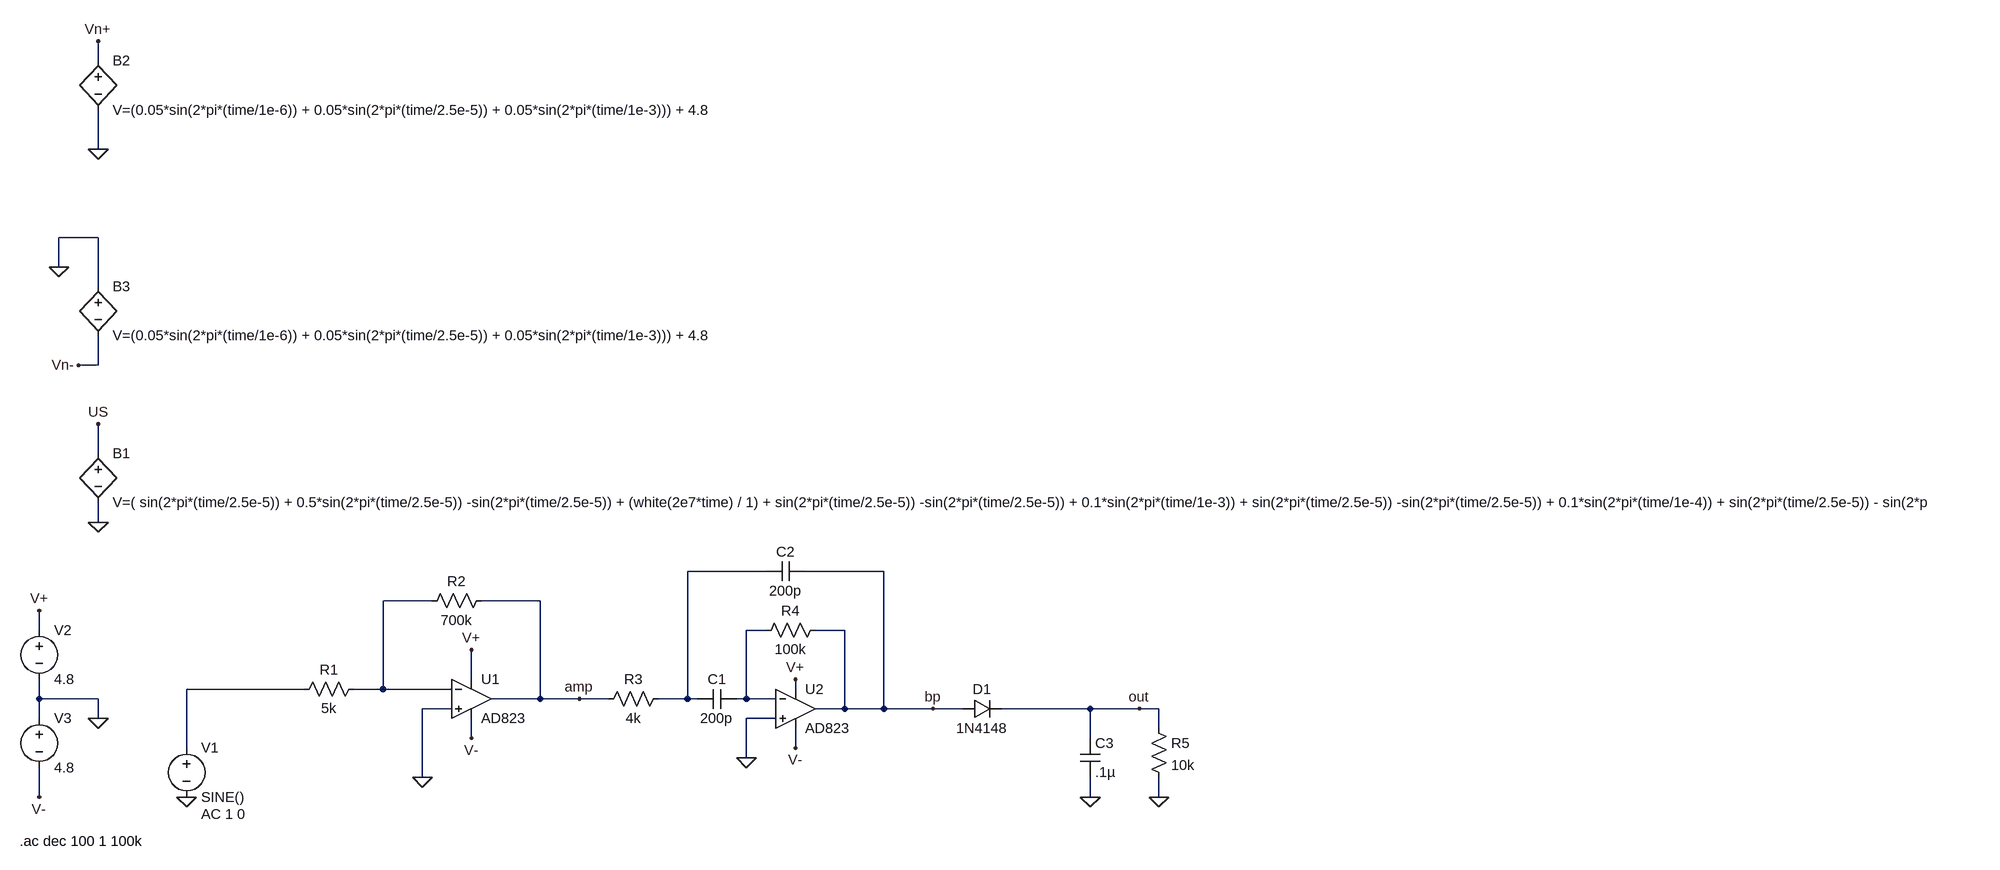
[diagram p0: schematic Simulation.asc]
Simulation.asc, the LTspice schematic file:
Version 4
SHEET 1 7124 680
WIRE -208 -1056 -208 -1088
WIRE -208 -912 -208 -976
WIRE -208 -768 -272 -768
WIRE -272 -720 -272 -768
WIRE -208 -688 -208 -768
WIRE -208 -560 -208 -608
WIRE -208 -560 -240 -560
WIRE -208 -416 -208 -464
WIRE -208 -304 -208 -336
WIRE 880 -224 752 -224
WIRE 1072 -224 944 -224
WIRE 336 -176 256 -176
WIRE 512 -176 416 -176
WIRE -304 -128 -304 -160
WIRE 880 -128 848 -128
WIRE 1008 -128 960 -128
WIRE 400 -48 400 -96
WIRE 128 -32 -64 -32
WIRE 256 -32 256 -176
WIRE 256 -32 208 -32
WIRE 368 -32 256 -32
WIRE 928 -32 928 -48
WIRE -304 -16 -304 -48
WIRE -208 -16 -304 -16
WIRE 512 -16 512 -176
WIRE 512 -16 432 -16
WIRE 576 -16 512 -16
WIRE 624 -16 576 -16
WIRE 752 -16 752 -224
WIRE 752 -16 704 -16
WIRE 768 -16 752 -16
WIRE 848 -16 848 -128
WIRE 848 -16 832 -16
WIRE 896 -16 848 -16
WIRE 368 0 320 0
WIRE 1008 0 1008 -128
WIRE 1008 0 960 0
WIRE 1072 0 1072 -224
WIRE 1072 0 1008 0
WIRE 1152 0 1072 0
WIRE 1200 0 1152 0
WIRE 1408 0 1264 0
WIRE 1488 0 1408 0
WIRE 1520 0 1488 0
WIRE -304 16 -304 -16
WIRE -208 16 -208 -16
WIRE 896 16 848 16
WIRE 1520 32 1520 0
WIRE 400 48 400 16
WIRE 1408 48 1408 0
WIRE -64 64 -64 -32
WIRE 928 64 928 32
WIRE 848 80 848 16
WIRE 320 112 320 0
WIRE -304 144 -304 96
WIRE 1408 144 1408 112
WIRE 1520 144 1520 112
FLAG 320 112 0
FLAG -208 16 0
FLAG -304 -160 V+
FLAG -304 144 V-
FLAG 400 -96 V+
FLAG 400 48 V-
FLAG 848 80 0
FLAG 928 -48 V+
FLAG 928 64 V-
FLAG -208 -304 0
FLAG -208 -464 US
FLAG 1408 144 0
FLAG 1520 144 0
FLAG 1488 0 out
FLAG 576 -16 amp
FLAG 1152 0 bp
FLAG -208 -1088 Vn+
FLAG -272 -720 0
FLAG -240 -560 Vn-
FLAG -208 -912 0
FLAG -64 144 0
SYMBOL res 224 -48 R90
WINDOW 0 0 56 VBottom 2
WINDOW 3 32 56 VTop 2
SYMATTR InstName R1
SYMATTR Value 5k
SYMBOL res 432 -192 R90
WINDOW 0 0 56 VBottom 2
WINDOW 3 32 56 VTop 2
SYMATTR InstName R2
SYMATTR Value 700k
SYMBOL voltage -304 -144 R0
WINDOW 123 0 0 Left 0
WINDOW 39 0 0 Left 0
SYMATTR InstName V2
SYMATTR Value 4.8
SYMBOL voltage -304 0 R0
WINDOW 123 0 0 Left 0
WINDOW 39 0 0 Left 0
SYMATTR InstName V3
SYMATTR Value 4.8
SYMBOL Opamps\\AD823 400 -80 R0
SYMATTR InstName U1
SYMBOL res 720 -32 R90
WINDOW 0 0 56 VBottom 2
WINDOW 3 32 56 VTop 2
SYMATTR InstName R3
SYMATTR Value 4k
SYMBOL res 976 -144 R90
WINDOW 0 0 56 VBottom 2
WINDOW 3 32 56 VTop 2
SYMATTR InstName R4
SYMATTR Value 100k
SYMBOL cap 832 -32 R90
WINDOW 0 0 32 VBottom 2
WINDOW 3 32 32 VTop 2
SYMATTR InstName C1
SYMATTR Value 200p
SYMBOL cap 944 -240 R90
WINDOW 0 0 32 VBottom 2
WINDOW 3 32 32 VTop 2
SYMATTR InstName C2
SYMATTR Value 200p
SYMBOL Opamps\\AD823 928 -64 R0
SYMATTR InstName U2
SYMBOL bv -208 -432 R0
SYMATTR InstName B1
SYMATTR Value V=( sin(2*pi*(time/2.5e-5)) + 0.5*sin(2*pi*(time/2.5e-5)) -sin(2*pi*(time/2.5e-5)) + (white(2e7*time) / 1) + sin(2*pi*(time/2.5e-5)) -sin(2*pi*(time/2.5e-5)) + 0.1*sin(2*pi*(time/1e-3)) + sin(2*pi*(time/2.5e-5)) -sin(2*pi*(time/2.5e-5)) + 0.1*sin(2*pi*(time/1e-4)) + sin(2*pi*(time/2.5e-5)) - sin(2*pi*(time/2.5e-5)) + 0.1*sin(2*pi*(time/1e-5)) + delay(sin(2*pi*(time/2.5e-5)), 0.5e-3) + delay(-sin(2*pi*(time/2.5e-5)), 1.0e-3) )/500
SYMBOL diode 1200 16 R270
WINDOW 0 32 32 VTop 2
WINDOW 3 0 32 VBottom 2
SYMATTR InstName D1
SYMATTR Value 1N4148
SYMBOL cap 1392 48 R0
SYMATTR InstName C3
SYMATTR Value .1µ
SYMBOL res 1504 16 R0
SYMATTR InstName R5
SYMATTR Value 10k
SYMBOL bv -208 -1072 R0
SYMATTR InstName B2
SYMATTR Value V=(0.05*sin(2*pi*(time/1e-6)) + 0.05*sin(2*pi*(time/2.5e-5)) + 0.05*sin(2*pi*(time/1e-3))) + 4.8
SYMBOL bv -208 -704 R0
SYMATTR InstName B3
SYMATTR Value V=(0.05*sin(2*pi*(time/1e-6)) + 0.05*sin(2*pi*(time/2.5e-5)) + 0.05*sin(2*pi*(time/1e-3))) + 4.8
SYMBOL voltage -64 48 R0
WINDOW 123 24 124 Left 2
WINDOW 39 0 0 Left 0
SYMATTR InstName V1
SYMATTR Value SINE()
SYMATTR Value2 AC 1 0
TEXT -336 216 Left 2 !.ac dec 100 1 100k

The netlist it stands for:
* Simulation.asc
R1 N002 N004 5k
R2 amp N002 700k
V2 V+ 0 4.8
V3 0 V- 4.8
XU1 0 N002 V+ V- amp AD823  ; pins In+ In- V+ V- OUT
R3 N001 amp 4k
R4 bp N003 100k
C1 N003 N001 200p
C2 bp N001 200p
XU2 0 N003 V+ V- bp AD823  ; pins In+ In- V+ V- OUT
B1 US 0 V=( sin(2*pi*(time/2.5e-5)) + 0.5*sin(2*pi*(time/2.5e-5)) -sin(2*pi*(time/2.5e-5)) + (white(2e7*time) / 1) + sin(2*pi*(time/2.5e-5)) -sin(2*pi*(time/2.5e-5)) + 0.1*sin(2*pi*(time/1e-3)) + sin(2*pi*(time/2.5e-5)) -sin(2*pi*(time/2.5e-5)) + 0.1*sin(2*pi*(time/1e-4)) + sin(2*pi*(time/2.5e-5)) - sin(2*pi*(time/2.5e-5)) + 0.1*sin(2*pi*(time/1e-5)) + delay(sin(2*pi*(time/2.5e-5)), 0.5e-3) + delay(-sin(2*pi*(time/2.5e-5)), 1.0e-3) )/500
D1 bp out 1N4148
C3 out 0 .1µ
R5 out 0 10k
B2 Vn+ 0 V=(0.05*sin(2*pi*(time/1e-6)) + 0.05*sin(2*pi*(time/2.5e-5)) + 0.05*sin(2*pi*(time/1e-3))) + 4.8
B3 0 Vn- V=(0.05*sin(2*pi*(time/1e-6)) + 0.05*sin(2*pi*(time/2.5e-5)) + 0.05*sin(2*pi*(time/1e-3))) + 4.8
V1 N004 0 SINE() AC 1 0
.model D D
.lib standard.dio
.ac dec 100 1 100k
.lib ADI.lib
.backanno
.end